# EAGLE design D1 Breakout - LCD TH Dupont RJ45 Logo (EAGLE 9.4.2)
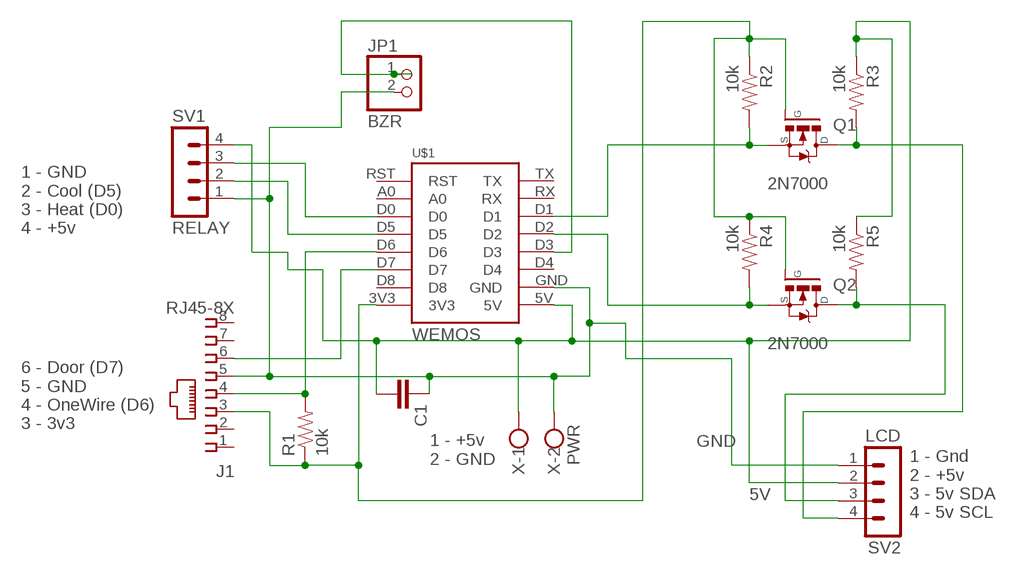
[diagram p0: schematic, sheet 1]

## Parts
C1  100uF  C5/3  [C5B3]
J1  RJ45-8X  [RJ45-NO-SHIELD-NOLINE]
JP1  BZR  PINHD-1X2  [1X02]
Q1  2N7000  [TO-92]
Q2  2N7000  [TO-92]
R1  10k  10KOHM-HORIZ-1/4W-1%  [AXIAL-0.3]
R2  10k  10KOHM-HORIZ-1/4W-1%  [AXIAL-0.3]
R3  10k  10KOHM-HORIZ-1/4W-1%  [AXIAL-0.3]
R4  10k  10KOHM-HORIZ-1/4W-1%  [AXIAL-0.3]
R5  10k  10KOHM-HORIZ-1/4W-1%  [AXIAL-0.3]
SV1  RELAY  MA04-1  [MA04-1]
SV2  LCD  MA04-1  [MA04-1]
U$1  WEMOS  [WEMOS]
X  PWR  W237-102  [W237-102]

## Nets
3V3 [3v]: J1.3 Q1.2(G) Q2.2(G) R1.P$1 R2.P$1 R4.P$1 U$1.3V3
5V [5v]: C1.2 R3.P$1 R5.P$1 SV1.4 SV2.2 U$1.5V X.1
5V_SDA: Q2.3(D) R5.P$2 SV2.3
D6: J1.4 R1.P$2 U$1.D6
D7: J1.6 U$1.D7
GND [Gnd]: C1.1 J1.5 JP1.2 SV1.1 SV2.1 U$1.GND X.2
N$1: Q2.1(S) R4.P$2 U$1.D2
N$5: Q1.1(S) R2.P$2 U$1.D1
N$6: JP1.1 U$1.D3
N$7: SV1.2 U$1.D5
N$8: SV1.3 U$1.D0
SCL5V: Q1.3(D) R3.P$2 SV2.4
Unconnected: J1.1 J1.2 J1.7 J1.8 U$1.A0 U$1.D4 U$1.D8 U$1.RST U$1.RX U$1.TX

## Notes on the sheet
- 1 - GND
  2 - Cool (D5)
  3 - Heat (D0)
  4 - +5v
- 6 - Door (D7)
  5 - GND
  4 - OneWire (D6) 
  3 - 3v3
- 1 - +5v
  2 - GND
- 1 - Gnd
  2 - +5v
  3 - 5v SDA
  4 - 5v SCL

## Library data of the parts
C1 = capacitor-wima:C: CAPACITOR naming: grid - package width
J1 = con-tycoelectronics:RJ45: CORCOM Modular RJ Jacks No Shield Source: www.tycoelectronics.com .. ENG_DS_1654001_1099_RJ_L_0507.pdf; MPN: RJ45-8X; OC_FARNELL: unknown; OC_NEWARK: 16R6101
JP1 = pinhead:PINHD-1X2: PIN HEADER
Q1 Q2 = transistor-fet:2N7000: N-Channel MOSFET
R1-R5 = SparkFun-Resistors:10KOHM: 10kΩ resistor A resistor is a passive two-terminal electrical component that implements electrical resistance as a circuit element. Resistors act to reduce current flow, and, at the same time, act to lower voltage levels within circuits. - Wikipedia; PROD_ID: RES-12183
SV1 SV2 = con-lstb:MA04-1: PIN HEADER; OC_FARNELL: unknown; OC_NEWARK: unknown
U$1 = 1455413453956-wemos:WEMOS
X = con-wago-500:W237-102: WAGO SCREW CLAMP; MPN: 237-102; OC_FARNELL: unknown; OC_NEWARK: 70K9898

## Net classes
0 default: width 0.305 mm, clearance 0.305 mm
1 5v: width 0.406 mm, clearance 0.406 mm
2 3v: width 0.406 mm, clearance 0.406 mm
3 Gnd: width 0.406 mm, clearance 0.406 mm

## Board
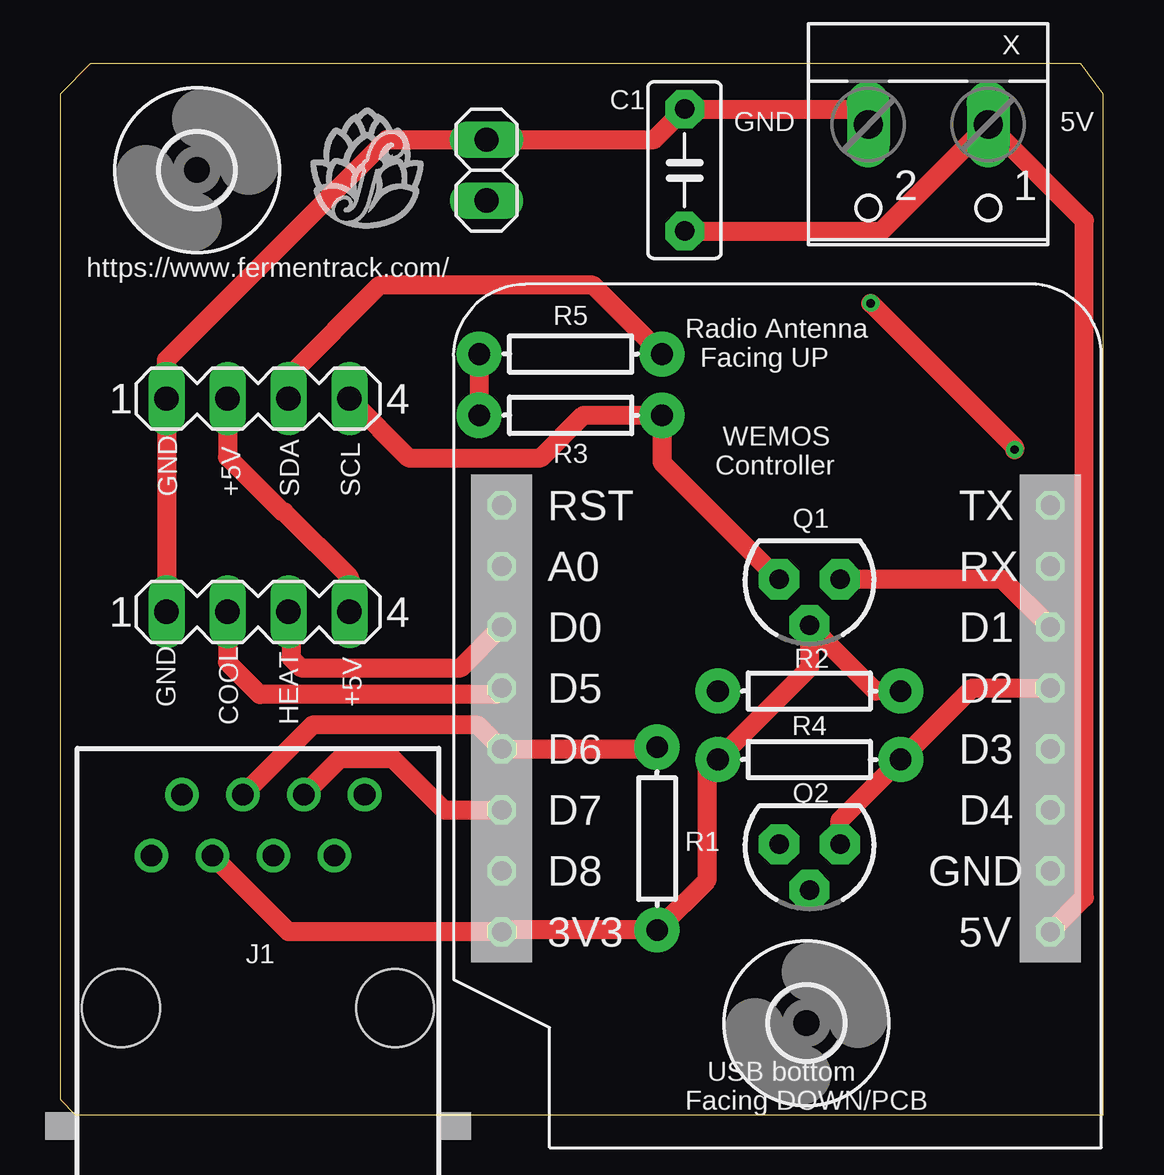
[diagram p1: board, top side]
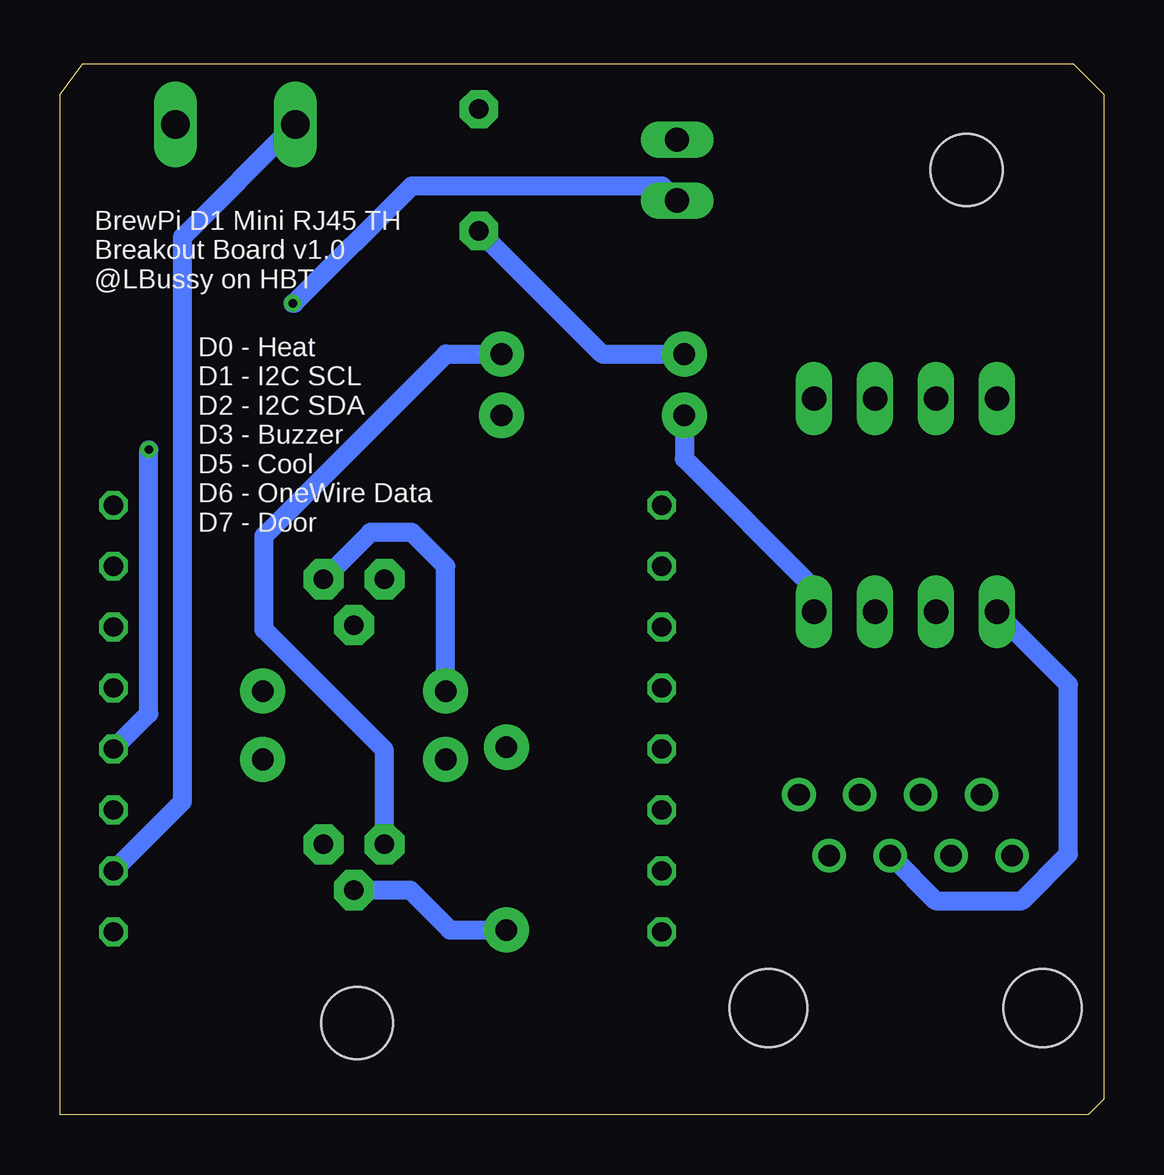
[diagram p2: board, bottom side, seen from below]

Size 43.48 x 43.81 mm. Coordinates in mm from the lower left corner, seen from the top.
Outline: 0,0.63 0.63,0 43.48,0 43.48,42.53 42.54,43.8 41.27,43.81 1.27,43.81 0,42.53 0,0.63
Copper layers (1*16): Top 0.0356mm / dielectric 1.5011mm / Bottom 0.0356mm
Design rules "PCBs_io *": minimum track width 6mil, minimum drill 13mil, track to track 8mil, track to pad 8mil, pad to pad 8mil, via to via 8mil, smd to smd 8mil, copper to edge 15mil, drill to drill 6mil, minimum pad ring 7mil, minimum via ring 7mil, stop-mask expansion 3mil, vias tented up to drill 0mil, thermal gap 10mil

### Footprints (pad centres in the part's own frame; a part is rotated, then mirrored left to right if it is on the bottom)
C5B3 = drill 0.813 pad 1.6 octagon: 1 -2.54,0; 2 2.54,0
RJ45-NO-SHIELD-NOLINE = drill 0.9 pad 1.4: 1 -4.445,6.35; 2 -3.175,8.89; 3 -1.905,6.35; 4 -0.635,8.89; 5 0.635,6.35; 6 1.905,8.89; 7 3.175,6.35; 8 4.445,8.89 | hole 3.251: -5.715,0; 5.715,0
1X02 = drill 1.016 long: 1 -1.27,0; 2 1.27,0
TO-92 = drill 0.813 pad 1.676 octagon: 1 -1.27,0; 2 0,1.905; 3 1.27,0
AXIAL-0.3 = drill 0.9 pad 1.88: P$1 -3.81,0; P$2 3.81,0
MA04-1 = drill 1.016 long: 1 -3.81,0; 2 -1.27,0; 3 1.27,0; 4 3.81,0
WEMOS = drill 0.8 octagon: 3V3 0,0; 5V 22.86,0; A0 0,15.24; D0 0,12.7; D1 22.86,12.7; D2 22.86,10.16; D3 22.86,7.62; D4 22.86,5.08; D5 0,10.16; D6 0,7.62; D7 0,5.08; D8 0,2.54; GND 22.86,2.54; RST 0,17.78; RX 22.86,15.24; TX 22.86,17.78
3,0 = hole 3: 0,0
W237-102 = drill 1.194 long: 1 -2.5,-1.27; 2 2.5,-1.27

### Placement (x,y rotation side)
C1  26.04,39.37 270 top
J1  8.25,4.44 0 top
JP1  17.78,39.37 90 top
Q1  31.24,22.31 180 top
Q2  31.24,11.26 180 top
R1  24.89,11.51 90 top
R2  31.24,17.66 180 top
R3  21.29,29.15 0 top
R4  31.24,14.8 0 top
R5  21.29,31.7 0 top
SV1  8.25,20.96 0 top
SV2  8.25,29.85 0 top
U$1  18.41,7.62 0 top
U$2  [3,0]  5.71,39.37 0 top
U$4  [3,0]  31.12,3.81 0 top
X  36.2,40 180 top

### Tracks (layer width: path | path; a pad name or v marks a point on that pad's centre or on a via)
3V3
  Top 0.8: R2.P$1 33.99,17.65 Q1.2 31.24,18.62 30.52,17.9 R4.P$1 26.99,14.36 26.99,9.79 R1.P$1 18.49,7.7 U$1.3V3 9.52,7.62 J1.3
  Bottom 0.8: Q2.2 28.9,9.36 27.24,7.7 R1.P$1
5V
  Top 0.8: C1.2 34.25,36.83 X.1 42.7,37.27 42.7,9.05 U$1.5V | R5.P$1 R3.P$1 | SV2.2 6.98,27.41 9.27,25.12 9.35,25.12 12.06,22.4 SV1.4
  Bottom 0.8: C1.2 20.91,31.7 R5.P$1 | SV1.4 12.06,21.93 17.48,27.34 R3.P$1
5V_SDA
  Top 0.8: R5.P$2 22.23,34.57 13.33,34.57 9.52,30.76 SV2.3
  Bottom 0.8: R5.P$2 27.41,31.7 34.99,24.12 34.99,20.22 29.97,15.2 Q2.3
D6
  Top 0.8: R1.P$2 24.82,15.24 U$1.D6 17.41,16.24 10.52,16.24 J1.4
D7
  Top 0.8: J1.6 11.66,14.83 13.88,14.83 16.02,12.7 U$1.D7
GND
  Top 0.8: SV1.1 SV2.1 4.45,31.46 13.62,40.64 JP1.2 24.76,40.64 C1.1 33.06,41.91 X.2
  Bottom 0.8: U$1.GND 38.39,13.04 38.39,36.58 X.2 | J1.5 7.01,8.92 3.39,8.92 1.46,10.85 1.46,17.92 4.45,20.9 SV1.1
N$1
  Top 0.8: Q2.1 32.51,12.27 R4.P$2 38.02,17.78 U$1.D2
N$5
  Top 0.8: U$1.D1 39.28,22.31 Q1.1
  Bottom 0.8: R2.P$2 27.43,22.87 28.83,24.27 30.56,24.27 Q1.1
N$6  (via drill 0.35)
  Top 0.8: v33.79,33.82 39.79,27.82 v39.79,27.72
  Bottom 0.8: JP1.1 18.39,38.71 28.84,38.71 33.73,33.82 v33.79,33.82 | U$1.D3 39.79,16.72 v39.79,27.72
N$7
  Top 0.8: SV1.2 6.98,18.85 8.33,17.5 18.14,17.5 U$1.D5
N$8
  Top 0.8: SV1.3 9.63,20.85 9.63,19.04 10.05,18.62 16.71,18.62 U$1.D0
SCL5V
  Top 0.8: SV2.4 14.53,27.37 20.05,27.37 21.82,29.15 R3.P$2 25.1,27.19 Q1.3

### Text on the board
tPlace: GND | 5V | https://www.fermentrack.com/ | GND | +5V | SDA | SCL | GND | COOL | HEAT | +5V
bNames: BrewPi D1 Mini RJ45 TH / Breakout Board v1.0 / @LBussy on HBT | D0 - Heat / D1 - I2C SCL / D2 - I2C SDA / D3 - Buzzer / D5 - Cool / D6 - OneWire Data / D7 - Door